# Altium schematic sheet 74HC165D,6531_74HC165D,653.schdoc
size 124 x 99 mm
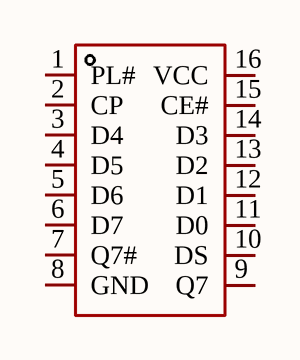
[diagram p0: 74HC165D,6531_74HC165D,653.schdoc]

## Parts
U?  74HC165D,653  [SOIC-16_L9.9-W3.9-P1.27-LS6.0-BL]  (value not drawn)

## Nets

Not connected (* = marked no-connect by the designer): U? 1(PL#) 2(CP) 3(D4) 4(D5) 5(D6) 6(D7) 7(Q7#) 8(GND) 9(Q7) 10(DS) 11(D0) 12(D1) 13(D2) 14(D3) 15(CE#) 16(VCC)

## Library data of the parts
U? = 74HC165D,653: Manufacturer: Nexperia(安世); Add into BOM: yes; Function: 并行或串行至串行; Supply Voltage: 2V~6V; Number of Elements: 1; Number of Bits per Element: 8; Output Type: 补充型; Symbol: 74HC165D,653; Device: 74HC165D,653; LCSC Part Name: 补充型输出 并行或串行至串行移位寄存器; Supplier Part: C5613; Manufacturer Part: 74HC165D,653; Supplier Footprint: SOIC-16; JLCPCB Part Class: Extended Part; Datasheet: https://atta.szlcsc.com/upload/public/pdf/source/20160218/1457707760975.pdf; Supplier: LCSC; Convert to PCB: yes; Series: 74HC; Operating Temperature: -40℃~+125℃